# Altium schematic sheet Avionics_Board.SchDoc: SPEXTRO - AVIONICS BOARD
size A4; Author: Adam R. Lehman; Revision: 0; SheetNumber: 1; SheetTotal: 5
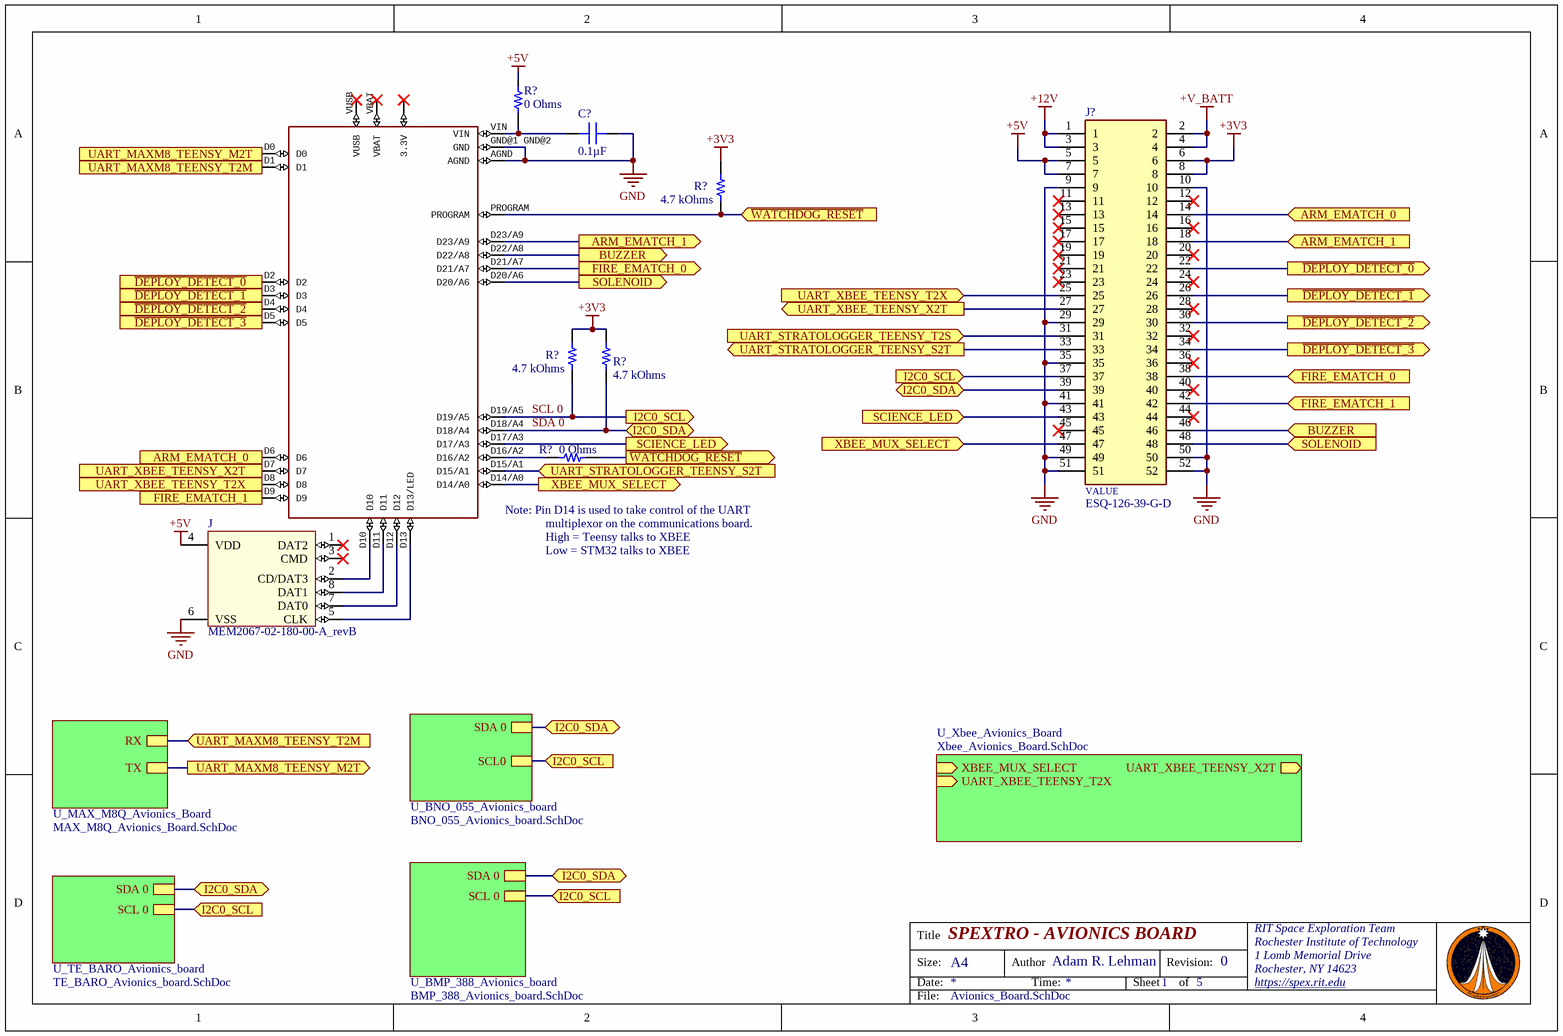
[diagram p0: Avionics_Board.SchDoc]

## Parts
(Parts that share a designator on the sheet are numbered #1, #2 ... from top to bottom, then left to right.)
?  TEENSY4.0  [TEENSY4.0]  (value not drawn)
C?  0.1µF  [CAP 0603_1608]
J  MEM2067-02-180-00-A_revB  [MEM2067-02-180-00-A_revB]
J?  ESQ-126-39-G-D  [SAMTEC_ESQ-126-39-G-D]
R?#1  0 Ohms  [RES 0603_1608]
R?#2  4.7 kOhms  [RES 0603_1608]
R?#3  4.7 kOhms  [RES 0603_1608]
R?#4  4.7 kOhms  [RES 0603_1608]
R?#5  0 Ohms  [RES 0603_1608]

## Sub-sheets
U_BMP_388_Avionics_board = BMP_388_Avionics_board.SchDoc: SDA 0, SCL 0
U_BNO_055_Avionics_board = BNO_055_Avionics_board.SchDoc: SDA 0, SCL0
U_MAX_M8Q_Avionics_Board = MAX_M8Q_Avionics_Board.SchDoc: RX, TX
U_TE_BARO_Avionics_board = TE_BARO_Avionics_board.SchDoc: SDA 0, SCL 0
U_Xbee_Avionics_Board = Xbee_Avionics_Board.SchDoc: XBEE_MUX_SELECT (in), UART_XBEE_TEENSY_X2T (out), UART_XBEE_TEENSY_T2X (in)

## Ports
ARM_EMATCH_0 (in), ARM_EMATCH_0 (out), ARM_EMATCH_1 (in), ARM_EMATCH_1 (out), BUZZER (in), BUZZER (out), FIRE_EMATCH_0 (in), FIRE_EMATCH_0 (out), FIRE_EMATCH_1 (in), FIRE_EMATCH_1 (out), I2C0_SCL (in), I2C0_SCL (out), I2C0_SDA (bidir), SCIENCE_LED (in), SCIENCE_LED (out), SOLENOID (in), SOLENOID (out), UART_MAXM8_TEENSY_M2T (in), UART_MAXM8_TEENSY_M2T (out), UART_MAXM8_TEENSY_T2M (in), UART_MAXM8_TEENSY_T2M (out), UART_STRATOLOGGER_TEENSY_S2T (in), UART_STRATOLOGGER_TEENSY_S2T (out), UART_STRATOLOGGER_TEENSY_T2S (in), UART_XBEE_TEENSY_T2X (in), UART_XBEE_TEENSY_T2X (out), UART_XBEE_TEENSY_X2T (in), UART_XBEE_TEENSY_X2T (out), XBEE_MUX_SELECT (in), XBEE_MUX_SELECT (out), ~{DEPLOY_DETECT_0} (in), ~{DEPLOY_DETECT_0} (out), ~{DEPLOY_DETECT_1} (in), ~{DEPLOY_DETECT_1} (out), ~{DEPLOY_DETECT_2} (in), ~{DEPLOY_DETECT_2} (out), ~{DEPLOY_DETECT_3} (in), ~{DEPLOY_DETECT_3} (out), ~{WATCHDOG_RESET} (in), ~{WATCHDOG_RESET} (out)

## Nets
+3V3: J?.6 J?.8 R?#2.1 R?#3.1 R?#4.1
+5V: J.4(VDD) J?.5 J?.7 R?#1.2
+12V: J?.1 J?.3
+V_BATT: J?.2 J?.4
GND: ?.AGND ?.GND@1_GND@2(GND) C?.1 J.6(VSS) J?.9 J?.10 J?.29 J?.35 J?.41 J?.49 J?.50 J?.51 J?.52
ARM_EMATCH_0: ?.D6 J?.14 ; port ARM_EMATCH_0
ARM_EMATCH_1: ?.D23/A9 J?.18 ; port ARM_EMATCH_1
BUZZER: ?.D22/A8 J?.46 ; port BUZZER
~{DEPLOY_DETECT_0}: ?.D2 J?.22 ; port ~{DEPLOY_DETECT_0}
~{DEPLOY_DETECT_1}: ?.D3 J?.26 ; port ~{DEPLOY_DETECT_1}
~{DEPLOY_DETECT_2}: ?.D4 J?.30 ; port ~{DEPLOY_DETECT_2}
~{DEPLOY_DETECT_3}: ?.D5 J?.34 ; port ~{DEPLOY_DETECT_3}
FIRE_EMATCH_0: ?.D21/A7 J?.38 ; port FIRE_EMATCH_0
FIRE_EMATCH_1: ?.D9 J?.42 ; port FIRE_EMATCH_1
SCIENCE_LED: ?.D17/A3 J?.43 ; port SCIENCE_LED
SCL 0: ?.D19/A5 J?.37 R?#3.2 ; port I2C0_SCL, sheet U_BMP_388_Avionics_board/SCL 0, sheet U_BNO_055_Avionics_board/SCL0, sheet U_TE_BARO_Avionics_board/SCL 0
SDA 0: ?.D18/A4 J?.39 R?#4.2 ; port I2C0_SDA, sheet U_BMP_388_Avionics_board/SDA 0, sheet U_BNO_055_Avionics_board/SDA 0, sheet U_TE_BARO_Avionics_board/SDA 0
SOLENOID: ?.D20/A6 J?.48 ; port SOLENOID
UART_MAXM8_TEENSY_M2T: ?.D0 ; port UART_MAXM8_TEENSY_M2T, sheet U_MAX_M8Q_Avionics_Board/TX
UART_MAXM8_TEENSY_T2M: ?.D1 ; port UART_MAXM8_TEENSY_T2M, sheet U_MAX_M8Q_Avionics_Board/RX
UART_STRATOLOGGER_TEENSY_S2T: ?.D15/A1 J?.33 ; port UART_STRATOLOGGER_TEENSY_S2T
UART_STRATOLOGGER_TEENSY_T2S: J?.31 ; port UART_STRATOLOGGER_TEENSY_T2S
UART_XBEE_TEENSY_T2X: ?.D8 J?.25 ; port UART_XBEE_TEENSY_T2X
UART_XBEE_TEENSY_X2T: ?.D7 J?.27 ; port UART_XBEE_TEENSY_X2T
~{WATCHDOG_RESET}: ?.PROGRAM R?#2.2 R?#5.1 ; port ~{WATCHDOG_RESET}
XBEE_MUX_SELECT: ?.D14/A0 J?.47 ; port XBEE_MUX_SELECT
Net?_D10: ?.D10 J.2(CD/DAT3)
Net?_D11: ?.D11 J.8(DAT1)
Net?_D12: ?.D12 J.7(DAT0)
Net?_D13: ?.D13(D13/LED) J.5(CLK)
Net?_D16/A2: ?.D16/A2 R?#5.2
Net?_VIN: ?.VIN C?.2 R?#1.1

Not connected (* = marked no-connect by the designer): ? ?1(3.3V)* VBAT* VUSB*; J 1(DAT2)* 3(CMD)*; J? 11* 12* 13* 15* 16* 17* 19* 20* 21* 23* 24* 28* 32* 36* 40* 44* 45*

## Notes on the sheet
- (near ?) Note: Pin D14 is used to take control of the UART
- multiplexor on the communications board.
- High = Teensy talks to XBEE
- Low = STM32 talks to XBEE
- Title
- Size:
- Date:
- A4
- Author
- Time:
- Sheet
- Revision:
- of
- RIT Space Exploration Team
- Rochester Institute of Technology
- 1 Lomb Memorial Drive
- Rochester, NY 14623
- https://spex.rit.edu
- File:
- (in symbol ESQ-126-39-G-D) VALUE

## Library data of the parts
? = TEENSY4.0: GateName_1: G$1; SymbolName_1: TEENSY4.0; LibraryName: Teensy4.0; DeviceSetName: TEENSY4.0; Package: TEENSY4.0
C? = 100X14W104MV4T: CAP CER 0.1UF 10V X7R 0603; Manufacturer: Johanson Dielectrics Inc.; Tolerance: ±20%; Part Number: 100X14W104MV4T; Value: 0.1µF; Applications: Bypass, Decoupling; Capacitance: 0.1µF; ComponentLink1Description: Datasheet; ComponentLink1URL: https://www.johansondielectrics.com/downloads/x2y-filter-and-decoupling-capacitors.pdf; ComponentLink2Description: DigiKey Link; ComponentLink2URL: http://digikey.com/product-detail/en/johanson-dielectrics-inc/100X14W104MV4T/709-1101-1-ND/1655915; Device Package: 0603 (1608 Metric); Features: Low ESL (X2Y); LastUpdated: 1/21/2020 12:02:09 AM; Lifecycle Status: Active; Minimum Order: 1; Mounting Type: Surface Mount, MLCC; Operating Temperature: -55°C ~ 125°C; Package / Case: 0603 (1608 Metric); Packaging: TapeAndReel; PartId: 2680; Part Status: Active; Price: 0.11; Series: X2Y®; Size / Dimension: 0.064" L x 0.035" W (1.63mm x 0.89mm); Supplier 1: DigiKey; Supplier Part Number 1: 709-1101-1-ND; Temperature Coefficient: X7R; Thickness (Max): 0.026" (0.66mm); Voltage - Rated: 10V
J = MEM2067-02-180-00-A_revB: Micro SD Memory Card ConnectorSMT, Hinged, 1.80mm Profile
J? = ESQ-126-39-G-D: 52 Position Elevated Socket Connector Through Hole; MF: Samtec; Value: *; Digi-Key_Purchase_URL: https://www.digikey.com/product-detail/en/samtec-inc/ESQ-126-39-G-D/SAM10462-ND/3601055?utm_source=snapeda&utm_medium=aggregator&utm_campaign=symbol; Package: None; MP: ESQ-126-39-G-D; SnapEDA_Link: https://www.snapeda.com/parts/ESQ-126-39-G-D/Samtec%20Inc./view-part/490181/?ref=snap; Digi-Key_Part_Number: SAM10462-ND
R?#1 R?#5 = PA0603-R-070RL: METAL CURRENT SENSOR-LOW T.C.R C; Manufacturer: Yageo; Power (Watts): 0.1W, 1/10W; Temperature Coefficient: ±150ppm/°C; Tolerance: Jumper; Part Number: PA0603-R-070RL; Value: 0 Ohms; ComponentLink1Description: Datasheet; ComponentLink1URL: http://www.yageo.com/NewPortal/_en/search/productDocs.jsp?YageoPartNumber=PA0603-R-070RL; ComponentLink2Description: DigiKey Link; ComponentLink2URL: http://digikey.com/product-detail/en/yageo/PA0603-R-070RL/YAG5757CT-ND/8256002; Composition: Metal Element; Device Package: 0603 (1608 Metric); Features: Current Sense, Moisture Resistant; Height - Seated (Max): 0.024" (0.60mm); LastUpdated: 1/21/2020 12:24:55 AM; Lifecycle Status: Active; Minimum Order: 1; Number of Terminations: 2; Operating Temperature: -55°C ~ 155°C; Package / Case: 0603 (1608 Metric); Packaging: TapeAndReel; PartId: 4862; Part Status: Active; Price: 0.09; Resistance: 0 Ohms; Series: PA; Size / Dimension: 0.063" L x 0.031" W (1.60mm x 0.80mm); Supplier 1: DigiKey; Supplier Part Number 1: YAG5757CT-ND; Supplier Device Package: 0603
R?#2-R?#4 = ERA-3AEB472V: RES SMD 4.7K OHM 0.1% 1/10W 0603; Manufacturer: Panasonic Electronic Components; Power (Watts): 0.1W, 1/10W; Temperature Coefficient: ±25ppm/°C; Part Number: ERA-3AEB472V; Value: 4.7 kOhms; ComponentLink1Description: Datasheet; ComponentLink1URL: https://industrial.panasonic.com/cdbs/www-data/pdf/RDM0000/AOA0000C307.pdf; ComponentLink2Description: DigiKey Link; ComponentLink2URL: http://digikey.com/product-detail/en/panasonic-electronic-components/ERA-3AEB472V/P4.7KDBCT-ND/1466068; Composition: Thin Film; Device Package: 0603 (1608 Metric); Features: Automotive AEC-Q200; Height - Seated (Max): 0.022" (0.55mm); LastUpdated: 1/21/2020 12:24:44 AM; Lifecycle Status: Active; Minimum Order: 1; Number of Terminations: 2; Operating Temperature: -55°C ~ 155°C; Package / Case: 0603 (1608 Metric); Packaging: TapeAndReel; PartId: 5519; Part Status: Active; Price: 0.04; Ratings: AEC-Q200; Resistance: 4.7 kOhms; Series: ERA-3A; Size / Dimension: 0.063" L x 0.031" W (1.60mm x 0.80mm); Supplier 1: DigiKey; Supplier Part Number 1: P4.7KDBCT-ND; Supplier Device Package: 0603; Tolerance: ±0.1%